# EAGLE design CCM_0010 (EAGLE 8.3.1)

## Sheet 1 of 2: control
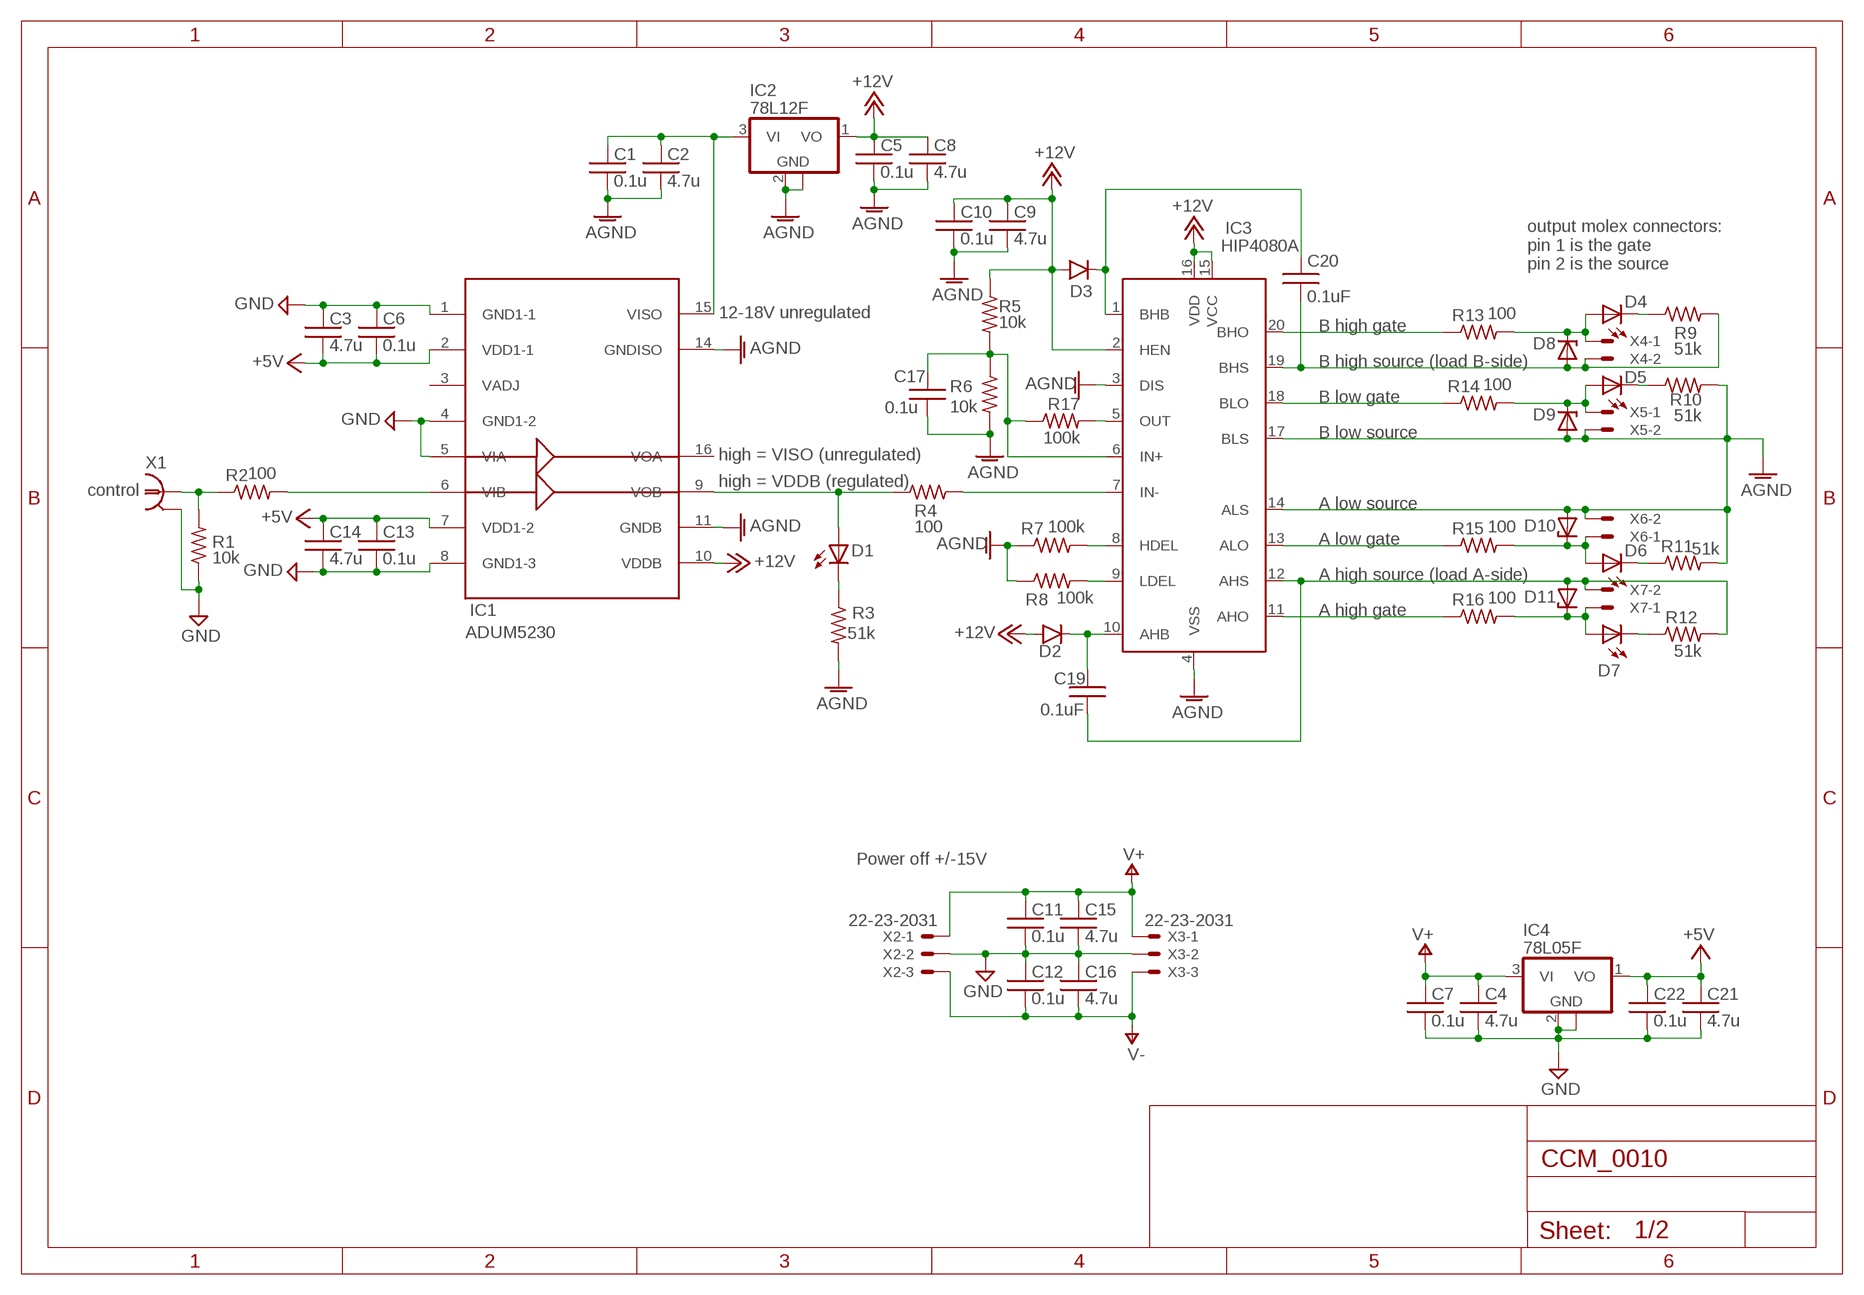
[diagram p0: schematic, sheet 1]

### Parts
C1  0.1u  C0603  [0603]
C2  4.7u  C0603  [0603]
C3  4.7u  C0603  [0603]
C4  4.7u  C0603  [0603]
C5  0.1u  C0603  [0603]
C6  0.1u  C0603  [0603]
C7  0.1u  C0603  [0603]
C8  4.7u  C0603  [0603]
C9  4.7u  C0603  [0603]
C10  0.1u  C0603  [0603]
C11  0.1u  C0603  [0603]
C12  0.1u  C0603  [0603]
C13  0.1u  C0603  [0603]
C14  4.7u  C0603  [0603]
C15  4.7u  C0603  [0603]
C16  4.7u  C0603  [0603]
C17  0.1u  C0603  [0603]
C19  0.1uF  C0603  [0603]
C20  0.1uF  C0603  [0603]
C21  4.7u  C0603  [0603]
C22  0.1u  C0603  [0603]
D1  LED0603  [LED0603]
D2  DIODESOT23  [SOT23-3]
D3  DIODESOT23  [SOT23-3]
D4  LED0603  [LED0603]
D5  LED0603  [LED0603]
D6  LED0603  [LED0603]
D7  LED0603  [LED0603]
D8  ZENER-DIODESOT23  [SOT23]
D9  ZENER-DIODESOT23  [SOT23]
D10  ZENER-DIODESOT23  [SOT23]
D11  ZENER-DIODESOT23  [SOT23]
IC1  ADUM5230  [SO16W]
IC2  78L12F  [SOT89]
IC3  HIP4080A  [SO20W]
IC4  78L05F  78L12F  [SOT89]
R1  10k  R0603  [0603]
R2  100  R0603  [0603]
R3  51k  R0603  [0603]
R4  100  R0603  [0603]
R5  10k  R0603  [0603]
R6  10k  R0603  [0603]
R7  100k  R0603  [0603]
R8  100k  R0603  [0603]
R9  51k  R0603  [0603]
R10  51k  R0603  [0603]
R11  51k  R0603  [0603]
R12  51k  R0603  [0603]
R13  100  R0603  [0603]
R14  100  R0603  [0603]
R15  100  R0603  [0603]
R16  100  R0603  [0603]
R17  100k  R0603  [0603]
X1  1-227161-0  [AMP_227161]
X2  22-23-2031  [22-23-2031]
X3  22-23-2031  [22-23-2031]
X4  22-23-2021  [22-23-2021]
X5  22-23-2021  [22-23-2021]
X6  22-23-2021  [22-23-2021]
X7  22-23-2021  [22-23-2021]

### Nets
+5V: C3.2 C6.2 C13.1 C14.1 C21.1 C22.1 IC1.2(VDD1-1) IC1.7(VDD1-2) IC4.1(VO)
+12V: C5.1 C8.1 C9.1 C10.1 D2.1(A) D3.1(A) IC1.10(VDDB) IC2.1(VO) IC3.2(HEN) IC3.15(VCC) IC3.16(VDD) R5.1
AGND: C1.2 C2.2 C5.2 C8.2 C9.2 C10.2 C17.2 D9.1(A) D10.1(A) IC1.11(GNDB) IC1.14(GNDISO) IC2.2(GND) IC2.2@1(GND) IC3.3(DIS) IC3.4(VSS) IC3.14(ALS) IC3.17(BLS) R3.2 R6.2 R7.1 R8.1 R10.2 R11.2 X5.2 X6.2
GND: C3.1 C4.2 C6.1 C7.2 C11.2 C12.1 C13.2 C14.2 C15.2 C16.1 C21.2 C22.2 IC1.1(GND1-1) IC1.4(GND1-2) IC1.5(VIA) IC1.8(GND1-3) IC4.2(GND) IC4.2@1(GND) R1.1 X1.2 X2.2 X3.2
N$1: D1.C R3.1
N$2: D4.C R9.1
N$3: D5.C R10.1
N$4: IC3.20(BHO) R13.1
N$5: D5.A D9.3(C) R14.2 X5.1
N$6: D6.C R11.1
N$7: D4.A D8.3(C) R13.2 X4.1
N$8: D1.A IC1.9(VOB) R4.1
N$9: D7.C R12.1
N$10: C1.1 C2.1 IC1.15(VISO) IC2.3(VI)
N$11: IC3.11(AHO) R16.1
N$12: IC3.13(ALO) R15.1
N$13: IC3.7(IN-) R4.2
N$16: IC3.9(LDEL) R8.2
N$17: C20.2 D3.3(C) IC3.1(BHB)
N$18: C20.1 D8.1(A) IC3.19(BHS) R9.2 X4.2
N$19: IC3.18(BLO) R14.1
N$20: IC3.5(OUT) R17.2
N$21: C19.1 D11.1(A) IC3.12(AHS) R12.2 X7.2
N$22: D7.A D11.3(C) R16.2 X7.1
N$23: C19.2 D2.3(C) IC3.10(AHB)
N$24: IC3.8(HDEL) R7.2
N$25: D6.A D10.3(C) R15.2 X6.1
N$28: R1.2 R2.1 X1.1
N$29: C17.1 IC3.6(IN+) R5.2 R6.1 R17.1
N$30: IC1.6(VIB) R2.2
V+: C4.1 C7.1 C11.1 C15.1 IC4.3(VI) X2.1 X3.1
V-: C12.2 C16.2 X2.3 X3.3
Unconnected: IC1.3(VADJ) IC1.16(VOA)

### Notes on the sheet
- output molex connectors:
  pin 1 is the gate
  pin 2 is the source
- 12-18V unregulated
- B high gate
- B high source (load B-side)
- B low gate
- B low source
- high = VISO (unregulated)
- high = VDDB (regulated)
- control
- A low source
- A low gate
- A high source (load A-side)
- A high gate
- Power off +/-15V

## Sheet 2 of 2: doc
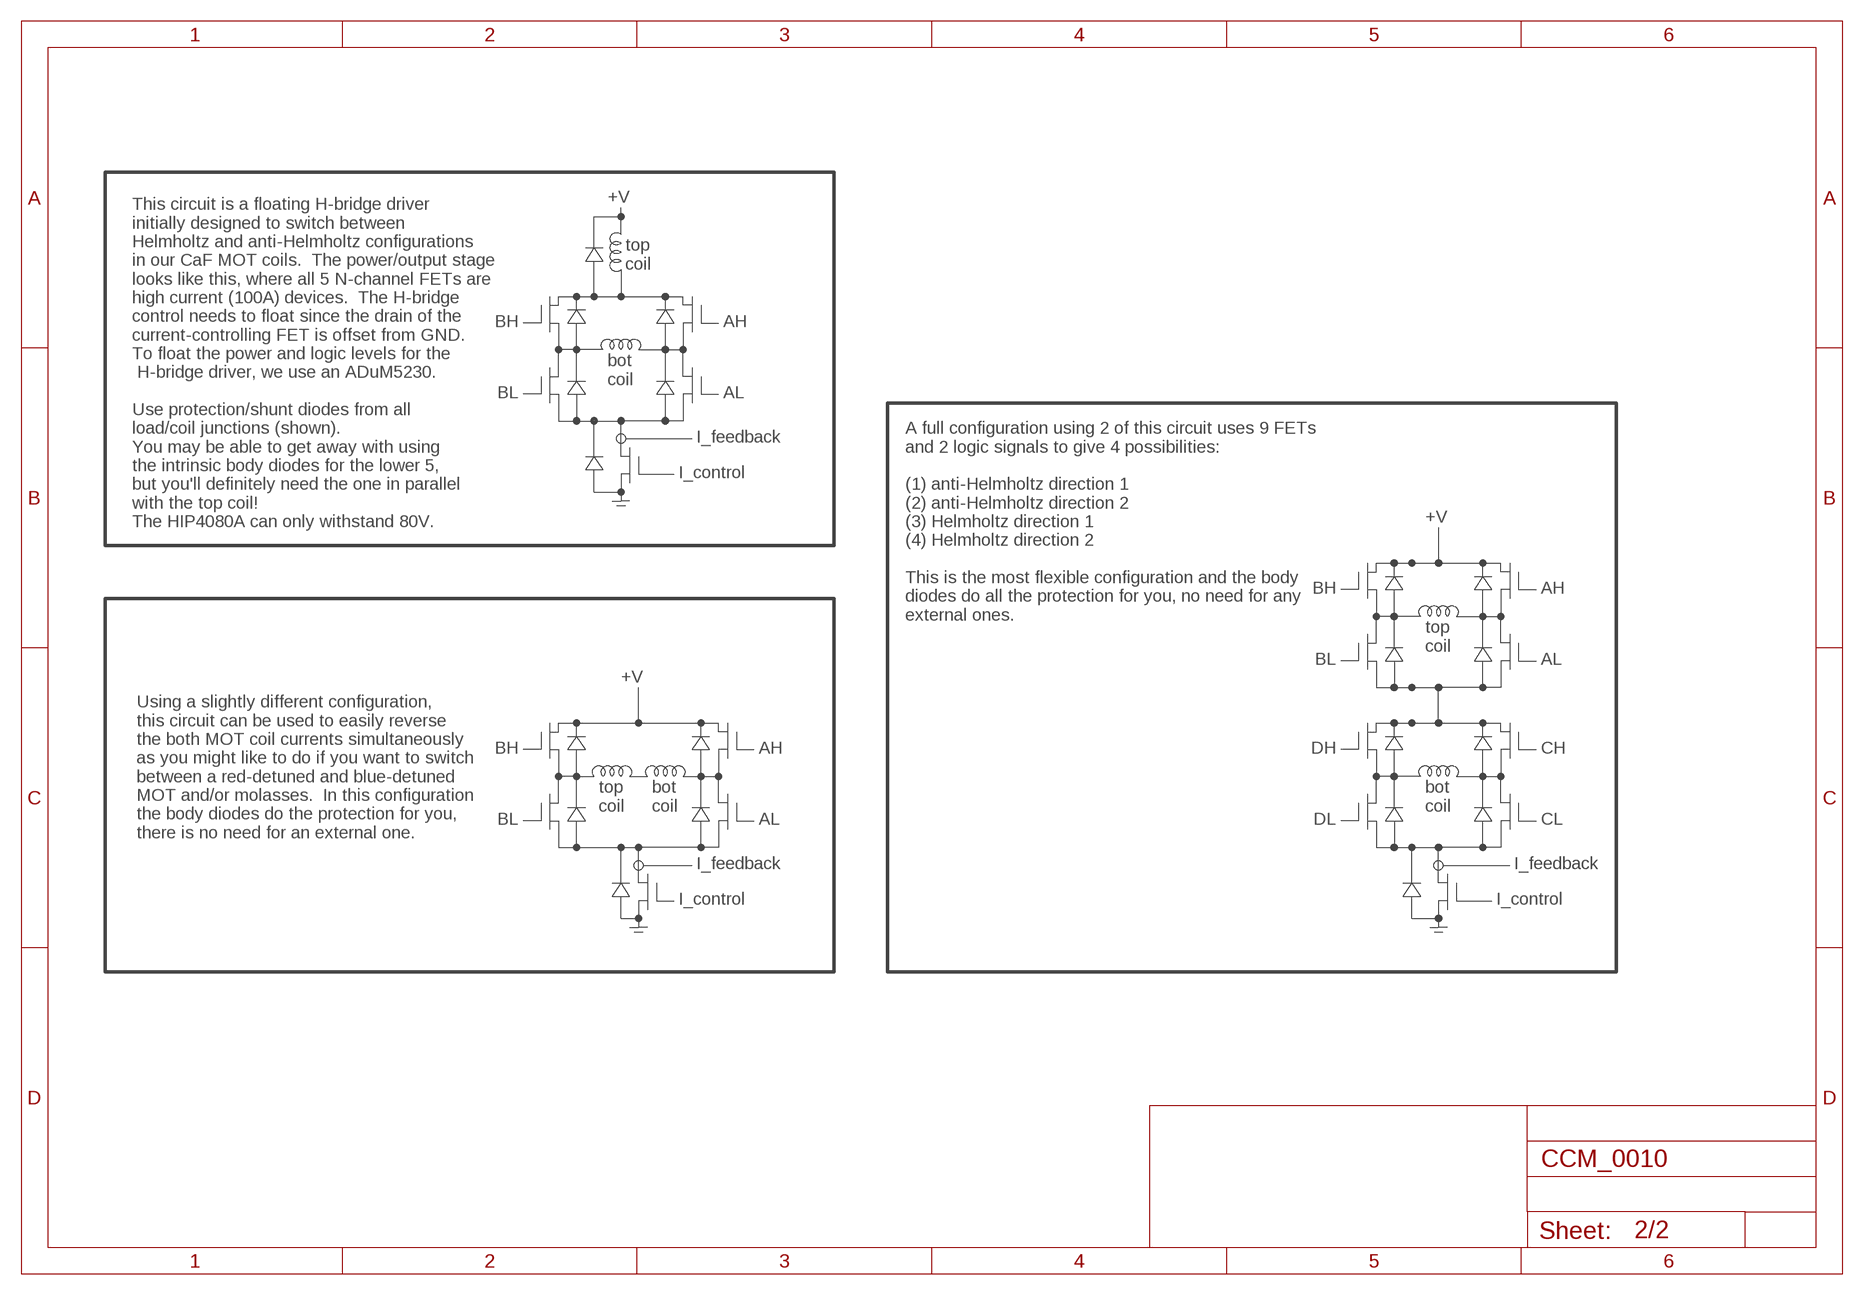
[diagram p1: schematic, sheet 2]

### Notes on the sheet
- +V
- top 
  coil
- BH | AH
- bot 
  coil
- BL | AL
- I_feedback
- I_control
- +V
- This circuit is a floating H-bridge driver
  initially designed to switch between 
  Helmholtz and anti-Helmholtz configurations 
  in our CaF MOT coils.  The power/output stage 
  looks like this, where all 5 N-channel FETs are 
  high current (100A) devices.  The H-bridge 
  control needs to float since the drain of the 
  current-controlling FET is offset from GND.  
  To float the power and logic levels for the 
   H-bridge driver, we use an ADuM5230.
  
  Use protection/shunt diodes from all 
  load/coil junctions (shown).  
  You may be able to get away with using
  the intrinsic body diodes for the lower 5,
  but you'll definitely need the one in parallel
  with the top coil! 
  The HIP4080A can only withstand 80V.
- BH | AH
- A full configuration using 2 of this circuit uses 9 FETs
  and 2 logic signals to give 4 possibilities:
  
  (1) anti-Helmholtz direction 1
  (2) anti-Helmholtz direction 2
  (3) Helmholtz direction 1
  (4) Helmholtz direction 2
  
  This is the most flexible configuration and the body
  diodes do all the protection for you, no need for any
  external ones.
- top 
  coil
- BL | AL
- +V
- BH | AH | DH | CH
- top 
  coil
- bot 
  coil
- bot 
  coil
- BL | AL | DL | CL
- Using a slightly different configuration, 
  this circuit can be used to easily reverse 
  the both MOT coil currents simultaneously 
  as you might like to do if you want to switch 
  between a red-detuned and blue-detuned 
  MOT and/or molasses.  In this configuration 
  the body diodes do the protection for you,
  there is no need for an external one.
- I_feedback | I_feedback
- I_control | I_control

## Library data of the parts
C1-C17 C19-C22 = acrooptics:C: Capacitor
D1 D4-D7 = acrooptics:LED: LED OSRAM: - CHIPLED LG R971, LG N971, LY N971, LG Q971, LY Q971, LO R971, LY R971 LH N974, LH R974 LS Q976, LO Q976, LY Q976 LO Q996 - Hyper CHIPLED LW Q18S LB Q993, LB Q99A, LB R99A - SideLED LS A670, LO A670, LY A670, LG A670, LP A670 LB A673, LV A673, LT A673, LW A673 LH A674 LY A675 LS A676, LA A676, LO A676, LY A676, LW A676 LS A679, LY A679, LG A679 - Hyper Micro SIDELED® LS Y876, LA Y876, LO Y876, LY Y876 LT Y87S - SmartLED LW L88C, LW L88S LB L89C, LB L89S, LG L890 LS L89K, LO L89K, LY L89K LS L896, LA L896, LO L896, LY L896 - TOPLED LS T670, LO T670, LY T670, LG T670, LP T670 LSG T670, LSP T670, LSY T670, LOP T670, LYG T670 LG T671, LOG T671, LSG T671 LB T673, LV T673, LT T673, LW T673 LH T674 LS T676, LA T676, LO T676, LY T676, LB T676, LH T676, LSB T676, LW T676 LB T67C, LV T67C, LT T67C, LS T67K, LO T67K, LY T67K, LW E67C LS E67B, LA E67B, LO E67B, LY E67B, LB E67C, LV E67C, LT E67C LW T67C LS T679, LY T679, LG T679 LS T770, LO T770, LY T770, LG T770, LP T770 LB T773, LV T773, LT T773, LW T773 LH T774 LS E675, LA E675, LY E675, LS T675 LS T776, LA T776, LO T776, LY T776, LB T776 LHGB T686 LT T68C, LB T68C - Hyper Mini TOPLED® LB M676 - Mini TOPLED Santana® LG M470 LS M47K, LO M47K, LY M47K Source: http://www.osram.convergy.de LUXEON: - LUMILED® LXK2-PW12-R00, LXK2-PW12-S00, LXK2-PW14-U00, LXK2-PW14-V00 LXK2-PM12-R00, LXK2-PM12-S00, LXK2-PM14-U00 LXK2-PE12-Q00, LXK2-PE12-R00, LXK2-PE12-S00, LXK2-PE14-T00, LXK2-PE14-U00 LXK2-PB12-K00, LXK2-PB12-L00, LXK2-PB12-M00, LXK2-PB14-N00, LXK2-PB14-P00, LXK2-PB14-Q00 LXK2-PR12-L00, LXK2-PR12-M00, LXK2-PR14-Q00, LXK2-PR14-R00 LXK2-PD12-Q00, LXK2-PD12-R00, LXK2-PD12-S00 LXK2-PH12-R00, LXK2-PH12-S00 LXK2-PL12-P00, LXK2-PL12-Q00, LXK2-PL12-R00 Source: www.luxeon.com KINGBRIGHT: KA-3528ASYC Source: www.kingbright.com
D2 D3 = WCSMain:DIODE: Diode These are standard reverse protection diodes and small signal diodes. SMA package can handle up to about 1A. SOD-323 can handle about 200mA. What the SOD-323 package when ordering, there are some mfgs out there that are 5-pin packages.
D8-D11 = WCSMain:ZENER-DIODE: Z-Diode
IC1 = noah:ADUM5230
IC2 IC4 = linear:78L*: POSITOIV-VOLTAGE REGULATORS Output up to 100 mA Source: Datasheet <http://focus.ti.com/lit/ds/symlink/ua78l05.pdf>
IC3 = noah:HIP4080A
R1-R17 = acrooptics:R: 0603 resistor
X1 = con-coax:?227161*: JACK, RIGHT ANGLE, 50 OHM, PCB, BNC Source: amp_227161.pdf; MF: TYCO ELECTRONICS; MPN: 1-227161; OC_FARNELL: unknown; OC_NEWARK: 33B3200
X2 X3 = con-molex:22-23-2031: .100" (2.54mm) Center Header - 3 Pin; MF: MOLEX; MPN: 22-23-2031; OC_FARNELL: 1462950; OC_NEWARK: 30C0862
X4-X7 = con-molex:22-23-2021: .100" (2.54mm) Center Header - 2 Pin; MF: MOLEX; MPN: 22-23-2021; OC_FARNELL: 1462926; OC_NEWARK: 25C3832

## Net classes
1 standard: width 0.61 mm, clearance 0.254 mm

## Board
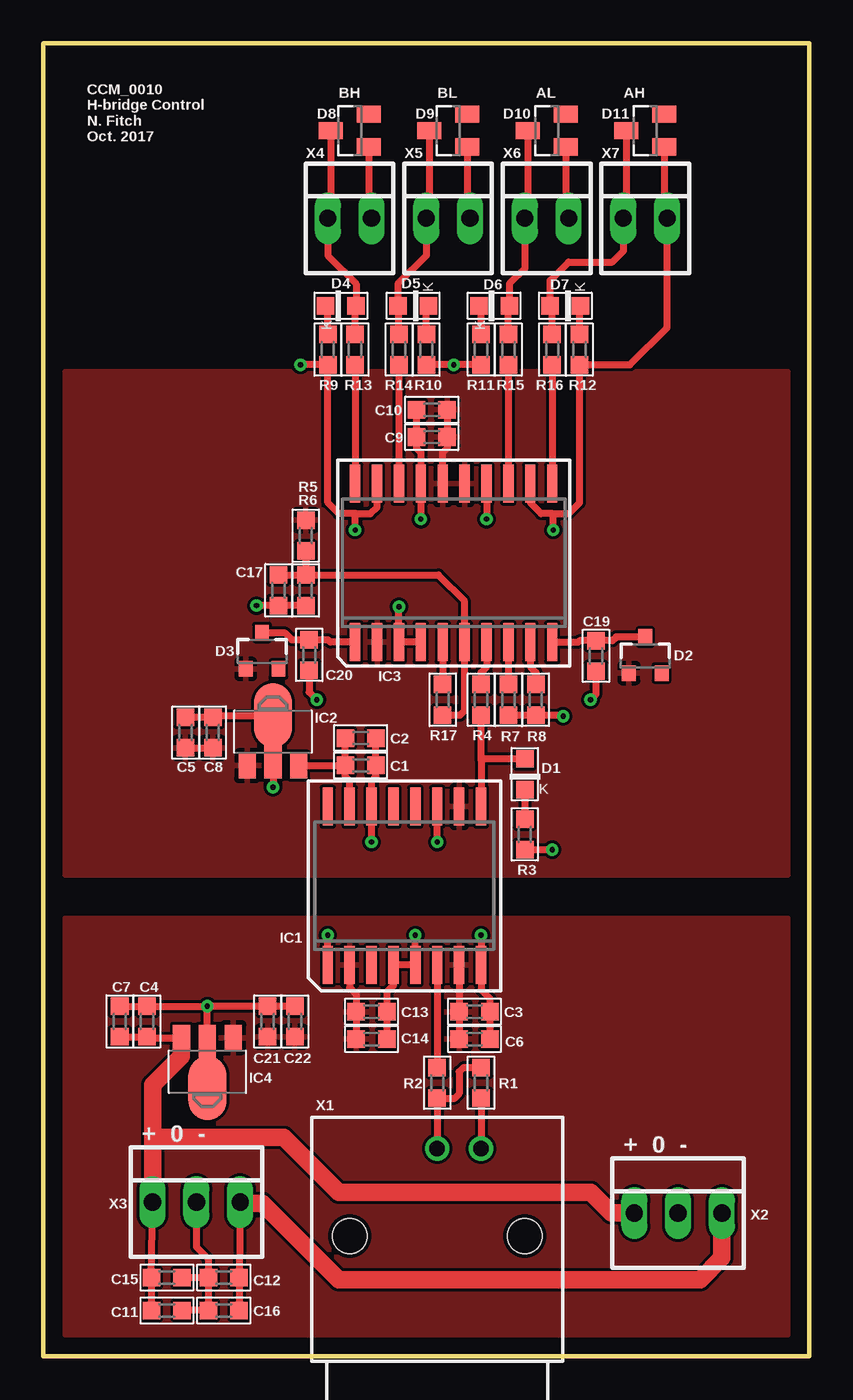
[diagram p2: board, top side]
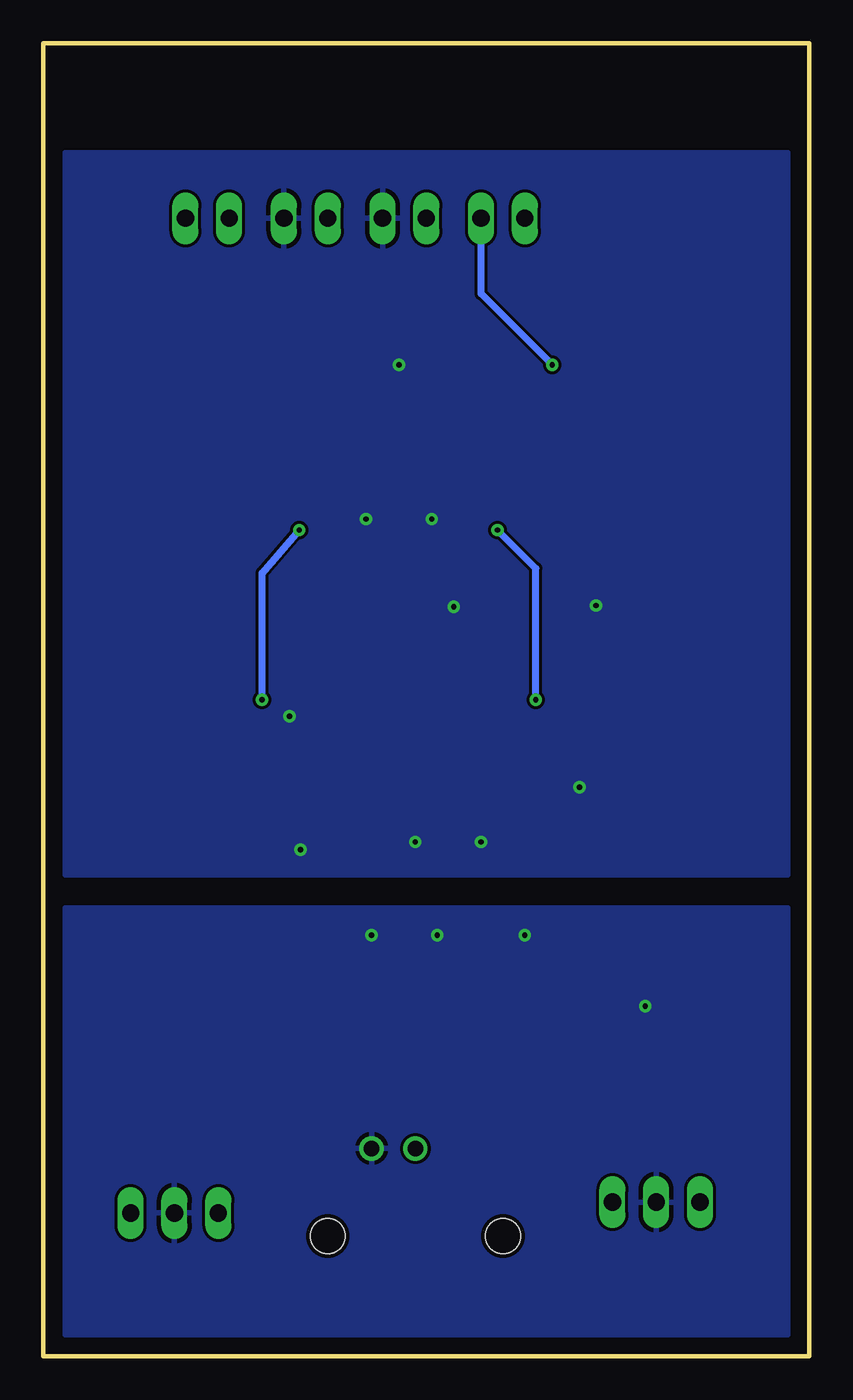
[diagram p3: board, bottom side, seen from below]

Size 44.45 x 76.2 mm. Coordinates in mm from the lower left corner, seen from the top.
Outline: 0,0 44.45,0 44.45,76.2 0,76.2 0,0
Copper layers (1*16): Top 0.035mm / dielectric 1.5mm / Bottom 0.035mm
Design rules "default *": minimum track width 10mil, minimum drill 10mil, track to track 7mil, track to pad 7mil, pad to pad 7mil, via to via 7mil, smd to smd 7mil, copper to edge 10mil, drill to drill 8mil, minimum pad ring 10mil, minimum via ring 8mil, stop-mask expansion 4mil, vias tented up to drill 0mil, thermal gap 10mil

### Footprints (pad centres in the part's own frame; a part is rotated, then mirrored left to right if it is on the bottom)
0603 = smd 1.016 x 1.016: 1 -0.889,0; 2 0.889,0
LED0603 = smd 1.016 x 1.016: A 0,-0.889; C 0,0.889
SOT23-3 = smd 0.8 x 0.9: 1 -0.95,-1; 2 0.95,-1; 3 0,1.1
SOT23 = smd 1 x 1.4: 1 -0.95,-1.1; 2 0.95,-1.1; 3 0,1.1
SO16W = smd 0.6 x 2.2: 1 -4.445,-4.6; 2 -3.175,-4.6; 3 -1.905,-4.6; 4 -0.635,-4.6; 5 0.635,-4.6; 6 1.905,-4.6; 7 3.175,-4.6; 8 4.445,-4.6; 9 4.445,4.6; 10 3.175,4.6; 11 1.905,4.6; 12 0.635,4.6; 13 -0.635,4.6; 14 -1.905,4.6; 15 -3.175,4.6; 16 -4.445,4.6
SOT89 = smd 1 x 1.5: 1 -1.499,-1.981; 3 1.499,-1.981 | smd 1 x 2: 2 0,-1.727 | smd 2.2 x 3.7: 2@1 0,0.94
SO20W = smd 0.6 x 2.2: 1 -5.715,-4.6; 2 -4.445,-4.6; 3 -3.175,-4.6; 4 -1.905,-4.6; 5 -0.635,-4.6; 6 0.635,-4.6; 7 1.905,-4.6; 8 3.175,-4.6; 9 4.445,-4.6; 10 5.715,-4.6; 11 5.715,4.6; 12 4.445,4.6; 13 3.175,4.6; 14 1.905,4.6; 15 0.635,4.6; 16 -0.635,4.6; 17 -1.905,4.6; 18 -3.175,4.6; 19 -4.445,4.6; 20 -5.715,4.6
AMP_227161 = drill 0.9 pad 1.27: 1 0,-5.08; 2 -2.54,-5.08 | hole 2: -5.08,0; 5.08,0
22-23-2031 = drill 1 long: 1 -2.54,0; 2 0,0; 3 2.54,0
22-23-2021 = drill 1 long: 1 -1.27,0; 2 1.27,0

### Placement (x,y rotation side)
C1  18.41,34.29 0 top
C2  18.41,35.88 0 top
C3  25.02,20 180 top
C4  6.03,19.43 90 top
C5  8.26,36.2 90 top
C6  25.02,18.41 180 top
C7  4.45,19.43 90 top
C8  9.84,36.2 90 top
C9  22.54,53.34 180 top
C10  22.54,54.93 180 top
C11  7.18,2.67 0 top
C12  10.48,4.57 0 top
C13  19.05,20 0 top
C14  19.05,18.41 0 top
C15  7.18,4.57 0 top
C16  10.48,2.67 0 top
C17  13.65,44.45 270 top
C19  32.07,40.64 90 top
C20  15.43,40.7 90 top
C21  13.02,19.43 90 top
C22  14.61,19.43 90 top
D1  27.94,33.78 180 top
D2  34.92,40.64 0 top
D3  12.7,40.89 0 top
D4  17.27,60.96 90 top
D5  21.46,60.96 270 top
D6  26.16,60.96 90 top
D7  30.29,60.96 270 top
D8  17.78,71.12 90 top
D9  23.5,71.12 90 top
D10  29.21,71.12 90 top
D11  34.92,71.12 90 top
IC1  20.95,27.3 0 top
IC2  13.34,36.26 0 top
IC3  23.81,46.04 0 top
IC4  9.53,16.51 180 top
R1  25.4,15.88 90 top
R2  22.86,15.88 90 top
R3  10k  [0603]  27.94,30.29 270 top
R4  25.4,38.1 90 top
R5  15.24,47.62 270 top
R6  15.24,44.45 270 top
R7  26.99,38.1 90 top
R8  28.57,38.1 90 top
R9  10k  [0603]  16.51,58.42 270 top
R10  10k  [0603]  22.23,58.42 270 top
R11  10k  [0603]  25.4,58.42 270 top
R12  10k  [0603]  31.11,58.42 270 top
R13  18.1,58.42 90 top
R14  20.64,58.42 90 top
R15  26.99,58.42 90 top
R16  29.53,58.42 90 top
R17  23.18,38.1 90 top
X1  22.86,6.99 180 top
X2  36.83,8.32 0 top
X3  8.89,8.95 0 top
X4  17.78,66.04 0 top
X5  23.5,66.04 0 top
X6  29.21,66.04 0 top
X7  34.92,66.04 0 top

### Tracks (layer width: path | path; a pad name or v marks a point on that pad's centre or on a via)
+5V
  Top 0.406: IC1.2 17.78,21.4 18.16,21.02 C13.1 C14.1 | IC1.7 C3.2 C6.2
  pour Top: 1.27,1.27 1.27,25.4 43.18,25.4 43.18,1.27
+12V
  Top 0.406: IC3.16 23.18,52.45 23.43,52.7 C9.1 C10.1 | C5.1 C8.1
  pour Top: 43.18,27.94 43.18,57.15 1.27,57.15 1.27,27.94
AGND  (via drill 0.3)
  Top 0.406: R3.2 v29.53,29.4 | v22.86,29.84 IC1.11 | v19.05,29.84 IC1.14 19.05,33.4 19.3,33.66 C1.2 C2.2 | v13.34,33.02 IC2.2 IC2.2@1 9.96,37.2 C8.2 C5.2 | IC3.4 IC3.3 v20.64,43.5 | R7.1 R8.1 30.1,37.21 v30.16,37.15 | R6.2 C17.2 v12.38,43.56 | C10.2 C9.2 21.65,52.7 21.91,52.45 IC3.17 v21.91,48.58 | IC3.14 v25.72,48.58 | R10.2 v23.81,57.53 R11.2 | D10.1 30.31,66.21 X6.2 | D9.1 24.59,66.21 X5.2
  pour Bottom: 1.27,27.94 1.27,69.85 43.18,69.85 43.18,27.94
GND  (via drill 0.3)
  Top 0.406: C11.2 C16.1 C12.1 | C12.1 C15.2 | X3.2 8.89,6.35 9.59,5.65 C12.1 | R1.1 X1.2 | v21.59,24.45 IC1.5 IC1.4 20.32,21.53 19.94,21.14 C13.2 C14.2 | v25.4,24.45 IC1.8 25.4,21.27 25.91,20.77 C3.1 C6.1 | IC1.1 v16.51,24.45 | C7.2 C4.2 v9.53,20.32 | v9.53,20.32 IC4.2 IC4.2@1 | C22.2 C21.2 v9.53,20.32
  pour Bottom: 1.27,1.27 1.27,26.04 43.18,26.04 43.18,1.27
N$1
  Top 0.406: D1.C R3.1
N$2
  Top 0.406: R9.1 16.51,60.83 D4.C
N$3
  Top 0.406: R10.1 22.23,60.83 D5.C
N$4
  Top 0.406: R13.1 IC3.20
N$5
  Top 0.406: R14.2 20.64,60.9 D5.A 20.57,62.23 22.23,63.88 X5.1 22.39,66.21 D9.3
N$6
  Top 0.406: R11.1 25.4,60.83 D6.C
N$7
  Top 0.406: R13.2 18.1,60.9 D4.A 18.16,62.23 16.51,63.88 X4.1 16.68,66.21 D8.3
N$8
  Top 0.406: 25.4,34.59 IC1.9 | 25.4,34.59 R4.1 | D1.A 25.48,34.67 25.4,34.59
N$9
  Top 0.406: R12.1 31.11,60.9 D7.C
N$10
  Top 0.406: C1.1 C2.1 | IC1.15 17.78,33.4 17.53,33.66 C1.1 | IC2.3 17.51,34.28 C1.1
N$11
  Top 0.406: R16.1 IC3.11
N$12
  Top 0.406: R15.1 IC3.13
N$13
  Top 0.406: IC3.7 25.72,40.01 25.4,39.69 R4.2
N$16
  Top 0.406: IC3.9 28.26,40.01 28.57,39.69 R8.2
N$17
  Top 0.406: IC3.1 16.66,41.44 16.51,41.59 C20.2 14.41,41.59 14.01,41.99 D3.3
N$18  (via drill 0.3)
  Top 0.406: D8.1 18.88,66.21 X4.2 | 18.16,48.9 17.14,48.9 16.51,49.53 R9.2 v14.92,57.53 | 18.16,48.9 18.99,48.9 19.37,49.28 IC3.19 | C20.1 15.43,38.54 v15.88,38.1 | v18.1,47.94 18.1,48.83 18.16,48.9
  Bottom 0.406: v14.92,57.53 19.05,61.66 X4.2 | v15.88,38.1 15.88,45.72 v18.1,47.94
N$19
  Top 0.406: R14.1 IC3.18
N$20
  Top 0.406: IC3.5 R17.2
N$21  (via drill 0.3)
  Top 0.406: D11.1 36.02,66.21 X7.2 36.2,59.69 34.04,57.53 R12.2 31.11,49.53 30.48,48.9 29.56,48.9 | 29.56,48.9 28.89,48.9 28.26,49.53 IC3.12 | C19.1 32.07,38.42 v31.75,38.1 | v29.59,47.94 29.59,48.86 29.56,48.9
  Bottom 0.406: v31.75,38.1 31.75,45.47 v29.59,47.94
N$22
  Top 0.406: R16.2 29.53,60.83 D7.A 29.4,62.42 30.48,63.5 33.02,63.5 33.66,64.14 X7.1 33.83,66.21 D11.3
N$23
  Top 0.406: IC3.10 31.02,41.44 31.11,41.53 C19.2 33.02,41.53 33.23,41.74 D2.3
N$24
  Top 0.406: IC3.8 R7.2
N$25
  Top 0.406: R15.2 26.99,60.9 D6.A 27.05,62.23 27.94,63.12 X6.1 28.11,66.21 D10.3
N$28
  Top 0.406: R2.1 X1.1 | R2.1 23.88,14.99 24.13,15.24 24.13,16.51 24.38,16.76 R1.2 | 22.86,15.3 R2.1
N$29
  Top 0.406: R5.2 R6.1 | C17.1 R6.1 | R6.1 22.92,45.34 24.45,43.81 IC3.6 24.45,37.47 24.19,37.21 R17.1
N$30
  Top 0.406: IC1.6 R2.2
V+
  Top 0.406: X3.1 C15.1 C11.1 | 8.01,18.48 IC4.3 6.08,18.49 C4.1 C7.1
  Top 1.016: 6.35,12.76 X3.1 | 6.35,12.76 6.35,15.75 8,17.4 8,18.47 IC4.3 | X2.1 32.96,8.32 31.75,9.53 17.14,9.53 13.97,12.7 6.41,12.7 6.35,12.76
V-
  Top 0.406: X3.3 C12.2 C16.2
  Top 1.016: X2.3 39.37,5.71 38.1,4.45 17.14,4.45 12.7,8.89 11.48,8.89 X3.3

### Text on the board
tPlace: BH | BL | AL | AH | CCM_0010 / H-bridge Control / N. Fitch / Oct. 2017 | + 0 - | + 0 -